# Altium project capstone_pcb.PrjPcb
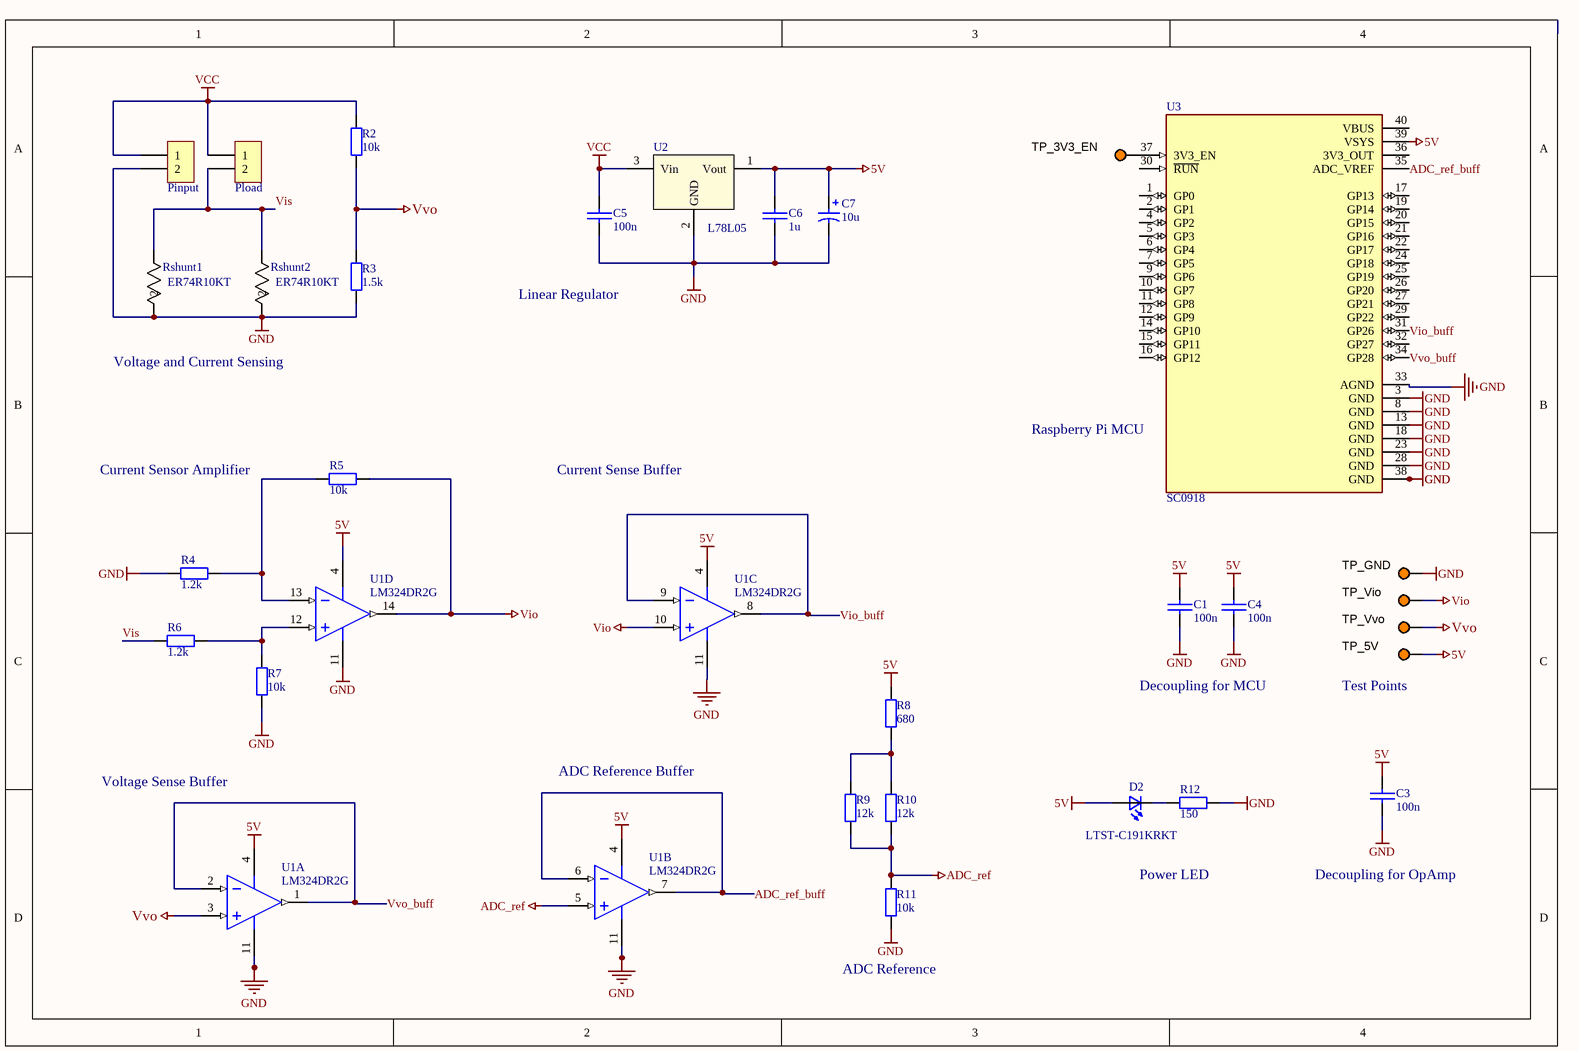
[diagram p0: Schematic.SchDoc]
1 sheet, 30 parts. Net scope: global (net labels, ports and power ports of the same name join across sheets).
Board files: PCB1.PcbDoc, PCB2.PcbDoc, PCB3.PcbDoc

## Sheet Schematic.SchDoc
size A4; SheetNumber: 1; SheetTotal: 1

### Parts
C1  100n  [0805 CAP]
C3  100n  [0805 CAP]
C4  100n  [0805 CAP]
C5  100n  [0805 CAP]
C6  1u  [0805 CAP]
C7  10u  [CAP-RAD-2.5mm Pitch]
D2  LTST-C191KRKT  [0603]
Pinput  Dual Banana Plugs  [Dual Banana Plug]  (value not drawn)
Pload  Dual Banana Plugs  [Dual Banana Plug]  (value not drawn)
R2  10k  [0805 RES]
R3  1.5k  [0805 RES]
R4  1.2k  [0805 RES]
R5  10k  [0805 RES]
R6  1.2k  [0805 RES]
R7  10k  [0805 RES]
R8  680  [0805 RES]
R9  12k  [0805 RES]
R10  12k  [0805 RES]
R11  10k  [0805 RES]
R12  150  [0805 RES]
Rshunt1  ER74R10KT  [RES_ER74_TYCO_TYC]
Rshunt2  ER74R10KT  [RES_ER74_TYCO_TYC]
TP_3V3_EN  5003  [TP_TH]  (value not drawn)
TP_5V  5003  [TP_TH]  (value not drawn)
TP_GND  5003  [TP_TH]  (value not drawn)
TP_Vio  5003  [TP_TH]  (value not drawn)
TP_Vvo  5003  [TP_TH]  (value not drawn)
U1  LM324DR2G  [SOIC-14]  (parts A,B,C,D of 4)
U2  L78L05  [SOT-89]
U3  SC0918  [RP Pico Header V2]

### Nets
5V: C1.1 C3.1 C4.1 C6.1 C7.1 D2.2(A2) R8.2 TP_5V.1 U1.4(VCC) U2.1(Vout) U3.39(VSYS)
ADC_ref: R9.1 R10.1 R11.2 U1.5(IN2+)
GND: C1.2 C3.2 C4.2 C5.2 C6.2 C7.2 Pinput.2 R3.1 R4.1 R7.1 R11.1 R12.1 Rshunt1.2 Rshunt2.2 TP_GND.1 U1.11(VEE/GND) U2.2(GND) U3.3(GND) U3.8(GND) U3.13(GND) U3.18(GND) U3.23(GND) U3.28(GND) U3.33(AGND) U3.38(GND)
VCC: C5.1 Pinput.1 Pload.1 R2.2 U2.3(Vin)
Vio: R5.2 TP_Vio.1 U1.10(IN3+) U1.14(OUT4)
Vvo: R2.1 R3.2 TP_Vvo.1 U1.3(IN1+)
ADC_ref_buff: U1.6(IN2-) U1.7(OUT2) U3.35(ADC_VREF)
Vio_buff: U1.8(OUT3) U1.9(IN3-) U3.31(GP26)
Vis: Pload.2 R6.1 Rshunt1.1 Rshunt2.1
Vvo_buff: U1.1(OUT1) U1.2(IN1-) U3.34(GP28)
NetD2_1: D2.1(K2) R12.2
NetR4_2: R4.2 R5.1 U1.13(IN4-)
NetR6_2: R6.2 R7.2 U1.12(IN4+)
NetR8_1: R8.1 R9.2 R10.2
NetTP_3V3_EN_1: TP_3V3_EN.1 U3.37(3V3_EN)

Not connected (* = marked no-connect by the designer): U3 1(GP0) 2(GP1) 4(GP2) 5(GP3) 6(GP4) 7(GP5) 9(GP6) 10(GP7) 11(GP8) 12(GP9) 14(GP10) 15(GP11) 16(GP12) 17(GP13) 19(GP14) 20(GP15) 21(GP16) 22(GP17) 24(GP18) 25(GP19) 26(GP20) 27(GP21) 29(GP22) 30(~{RUN}) 32(GP27) 36(3V3_OUT) 40(VBUS)

### Notes on the sheet
- Linear Regulator
- Voltage and Current Sensing
- (near U3) Raspberry Pi MCU
- Current Sensor Amplifier
- Current Sense Buffer
- Decoupling for MCU
- (near TP_5V) Test Points
- Voltage Sense Buffer
- ADC Reference Buffer
- Power LED
- Decoupling for OpAmp
- (near R11) ADC Reference

### Library data of the parts
C1 C3-C6 = CerCap_SMT_0805: SMT ceramic capacitor 0805 size; Value: *
C7 = ElecCap_TH_2P0: Electrolytic capacitor with radial package, 2mm pitch and 5.2mm diameter; Published: 8-Jun-2000; LatestRevisionDate: 17-Jul-2002; LatestRevisionNote: Re-released for DXP Platform.; PackageReference: POLAR0.8; Publisher: Altium Limited; PackageDescription: Polarized Capacitor; 2 Leads; Value: *
D2 = LTST-C191KRKT: http://octopart.com/ltst-c190krkt-lite-on-549893; Package: None; MP: LTST-C191KRKT; Value: *; Availability: Unavailable; Price: None
Pinput Pload = AC_Output: Dual banana plugs connection to the AC load; LatestRevisionDate: 17-Jul-2002; LatestRevisionNote: Re-released for DXP Platform.; Publisher: Altium Limited
R2-R12 = Res_SMT_0805: 0805 resistor; Published: 8-Jun-2000; LatestRevisionDate: 17-Jul-2002; LatestRevisionNote: Re-released for DXP Platform.; PackageReference: AXIAL-0.4; Publisher: Altium Limited; Value: *; ComponentLink1Description: https://nz.mouser.com/datasheet/2/315/AOA0000C304-1149620.pdf
Rshunt1 Rshunt2 = ER74R10KT: No Description Available; Mfr_Name: TE Connectivity; Digi-Key_Part_Number_2: A105885TB-ND; Digi-Key_Part_Number_1: A105885CT-ND
TP_3V3_EN TP_5V TP_GND TP_Vio TP_Vvo = TestPoint: Test Point, Orange, 1-Pin THD, RoHS; Peak Reverse Current: 600 uA; Forward Current: 3 A; Max Surge Current: 80 A; Forward Voltage: 1.08 V; Max Operating Temperature: 150 degC; PackageReference: 5003; Pins: 2; ComponentLink2URL: http://keyelco.com/userAssets/file/M65p56.pdf; PackageDescription: 1-Pin Through Hole Device, Dia 2.54 mm; Weight: 0.01 lb; Diameter: 5.3 mm; Mount: Through Hole; Package Quantity: 500; Packaging: Bulk; Min Operating Temperature: -65 degC; ComponentLink1Description: Manufacturer URL; Height: 0.25 inch; ComponentLink1URL: http://www.keyelco.com/; ComponentLink2Description: Datasheet; Width: 0.25 inch; REACH SVHC: No SVHC; RoHSCompliant: true; Radiation Hardening: No; Length: 9.5 mm; DatasheetVersion: Jun-15
U1 = LM324DR_SMT_SOIC16: Single Supply Quad Operational Amplifier, 3 to 32 V, 0 to 70 degC, 14-Pin SOIC, Pb-Free, Tape and Reel; Manufacturer: On Semiconductor; VCC Max (V): 32; VCC Min (V): 3; PackageVersion: Rev. K, 05/2011; ComponentLink3URL: http://www.onsemi.com/pub_link/Collateral/751A-03.PDF; ComponentLink3Description: Package Specification; Packing: Tape and Reel; ComponentLink2URL: http://www.onsemi.cn/pub_link/Collateral/LM324-D.PDF; PackageReference: SOIC-14-751A-03; ComponentLink1URL: http://www.onsemi.com/; PackageDescription: 14-Pin Small Outline Integrated Circuit, Body 8.65 x 3.9 mm, Pitch 1.27 mm; ComponentLink1Description: Manufacturer URL; DatasheetVersion: Rev. 25; Mounting Technology: Surface Mount; RoHS: TRUE; ComponentLink2Description: Datasheet; PartNumber: LM324DR2G
U2 = L78L05_SMT_SOT89: LDO Voltage Regulator 5V; ComponentLink1URL: http://www.st.com/content/ccc/resource/technical/document/datasheet/99/3b/7d/91/91/51/4b/be/CD00000544.pdf/files/CD00000544.pdf/jcr:content/translations/en.CD00000544.pdf; ComponentLink1Description: http://www.st.com/content/ccc/resource/technical/document/datasheet/99/3b/7d/91/91/51/4b/be/CD00000544.pdf/files/CD00000544.pdf/jcr:content/translations/en.CD00000544.pdf; Supplier 1: Digi-Key; Supplier Part Number 1: 497-1181-1-ND
U3 = SC0918: RP2040 Raspberry Pi Pico - ARMÂ® CortexÂ®-M0+ MCU 32-Bit Embedded Evaluation Board; MF: Raspberry Pi; Package: None; Price: None; Check_prices: https://www.snapeda.com/parts/SC0918/Raspberry+Pi/view-part/?ref=eda; Value: *; SnapEDA_Link: https://www.snapeda.com/parts/SC0918/Raspberry+Pi/view-part/?ref=snap; MP: SC0918; Availability: In Stock; Purchase-URL: https://pricing.snapeda.com/search/part/SC0918/?ref=eda